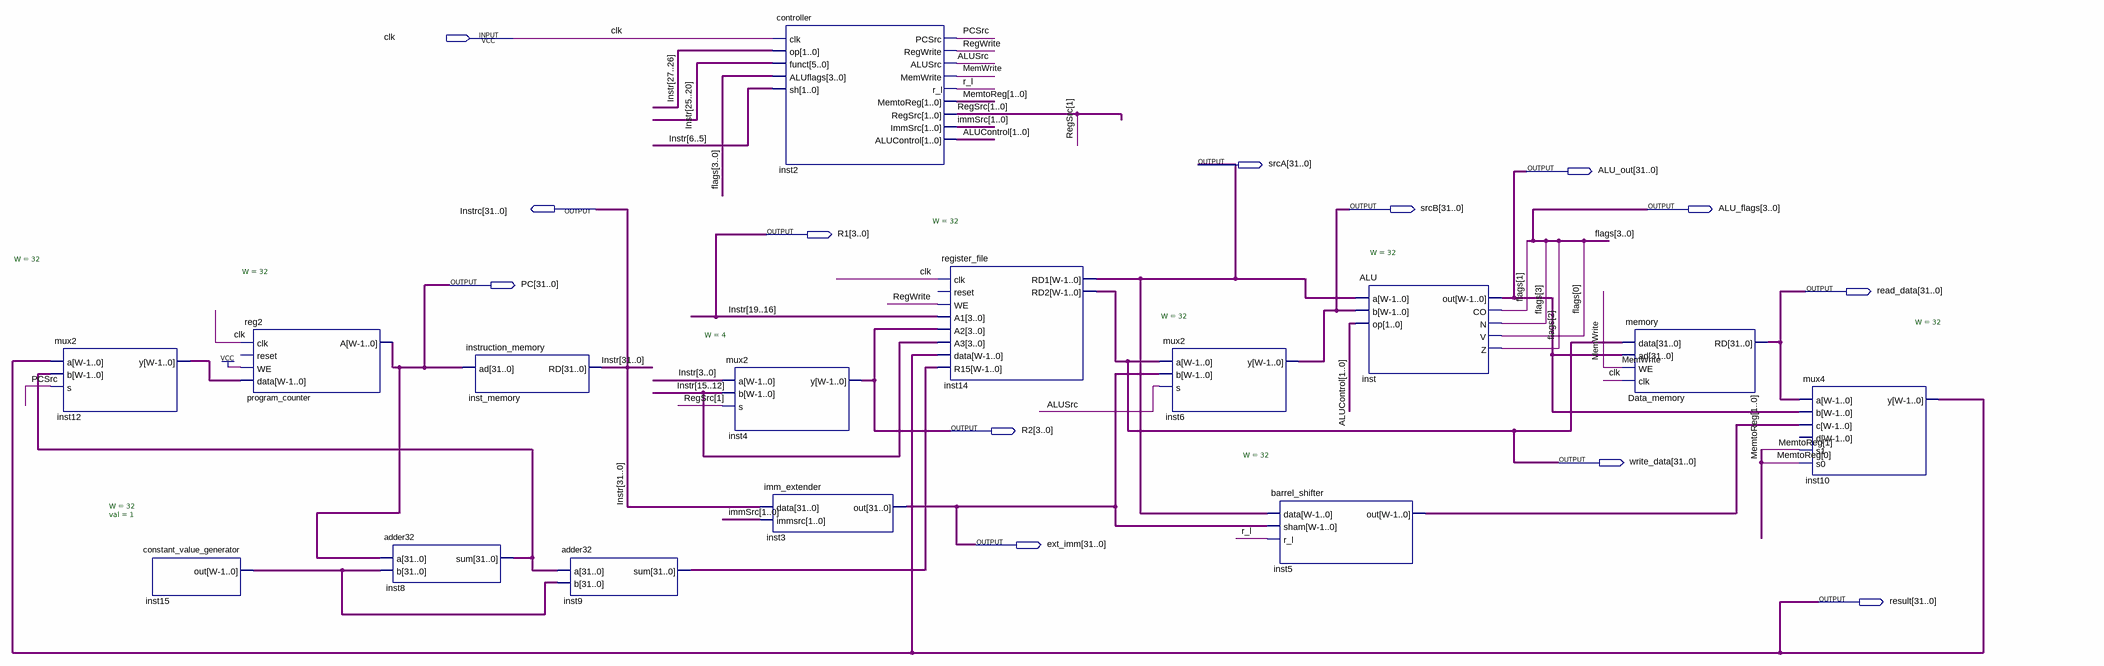
[diagram p0: schematic sheet]
// Quartus schematic datapath.bdf as structural Verilog: 15 symbols, 13 pins
module datapath (
  input  clk,
  output [31:0] srcA,
  output [31:0] ALU_out,
  output [31:0] Instrc,
  output [31:0] srcB,
  output [3:0] ALU_flags,
  output [3:0] R1,
  output [31:0] PC,
  output [31:0] read_data,
  output [3:0] R2,
  output [31:0] write_data,
  output [31:0] ext_imm,
  output [31:0] result
);

  wire ALUSrc, MemWrite, PCSrc, r_l, RegWrite;
  wire [1:0] ALUControl, immSrc, MemtoReg, RegSrc;
  wire [31:0] inst5_out, inst8_sum, inst9_sum, inst12_y, inst15_out;

  mux2 #(.W(32)) inst12 (.a(result), .b(inst8_sum), .s(PCSrc), .y(inst12_y));
  constant_value_generator #(.W(32), .val(1)) inst15 (.out(inst15_out));
  reg2 #(.W(32)) program_counter (.clk(clk), .WE(1'b1), .data(inst12_y), .A(PC));  // open: reset
  adder32 inst8 (.a(PC), .b(inst15_out), .sum(inst8_sum));
  instruction_memory inst_memory (.ad(PC), .RD(Instrc));
  adder32 inst9 (.a(inst8_sum), .b(inst15_out), .sum(inst9_sum));
  mux2 #(.W(4)) inst4 (.a(Instrc[3:0]), .b(Instrc[15:12]), .s(RegSrc[1]), .y(R2));
  controller inst2 (
    .clk(clk), .op(Instrc[27:26]), .funct(Instrc[25:20]), .ALUflags(ALU_flags), .sh(Instrc[6:5]),
    .PCSrc(PCSrc), .RegWrite(RegWrite), .ALUSrc(ALUSrc), .MemWrite(MemWrite), .r_l(r_l), .MemtoReg(MemtoReg),
    .RegSrc(RegSrc), .ImmSrc(immSrc), .ALUControl(ALUControl));
  imm_extender inst3 (.data(Instrc), .immsrc(immSrc), .out(ext_imm));
  register_file #(.W(32)) inst14 (
    .clk(clk), .WE(RegWrite), .A1(Instrc[19:16]), .A2(R2), .A3(Instrc[15:12]), .data(result),
    .R15(inst9_sum), .RD1(srcA), .RD2(write_data));  // open: reset
  mux2 #(.W(32)) inst6 (.a(write_data), .b(ext_imm), .s(ALUSrc), .y(srcB));
  barrel_shifter #(.W(32)) inst5 (.data(srcA), .sham(ext_imm), .r_l(r_l), .out(inst5_out));
  ALU #(.W(32)) inst (
    .a(srcA), .b(srcB), .op(ALUControl), .out(ALU_out), .CO(ALU_flags[1]), .N(ALU_flags[3]),
    .V(ALU_flags[0]), .Z(ALU_flags[2]));
  memory Data_memory (.data(write_data), .ad(ALU_out), .WE(MemWrite), .clk(clk), .RD(read_data));
  mux4 #(.W(32)) inst10 (
    .a(read_data), .b(ALU_out), .c(inst5_out), .s1(MemtoReg[1]), .s0(MemtoReg[0]), .y(result));  // open: d

  assign R1 = Instrc[19:16];

  // Other names for the same wires on the sheet: flags[3:0] = ALU_flags; Instr[31:0] = Instrc
endmodule
